# EAGLE design loop-rs232 (EAGLE 6.6.0)
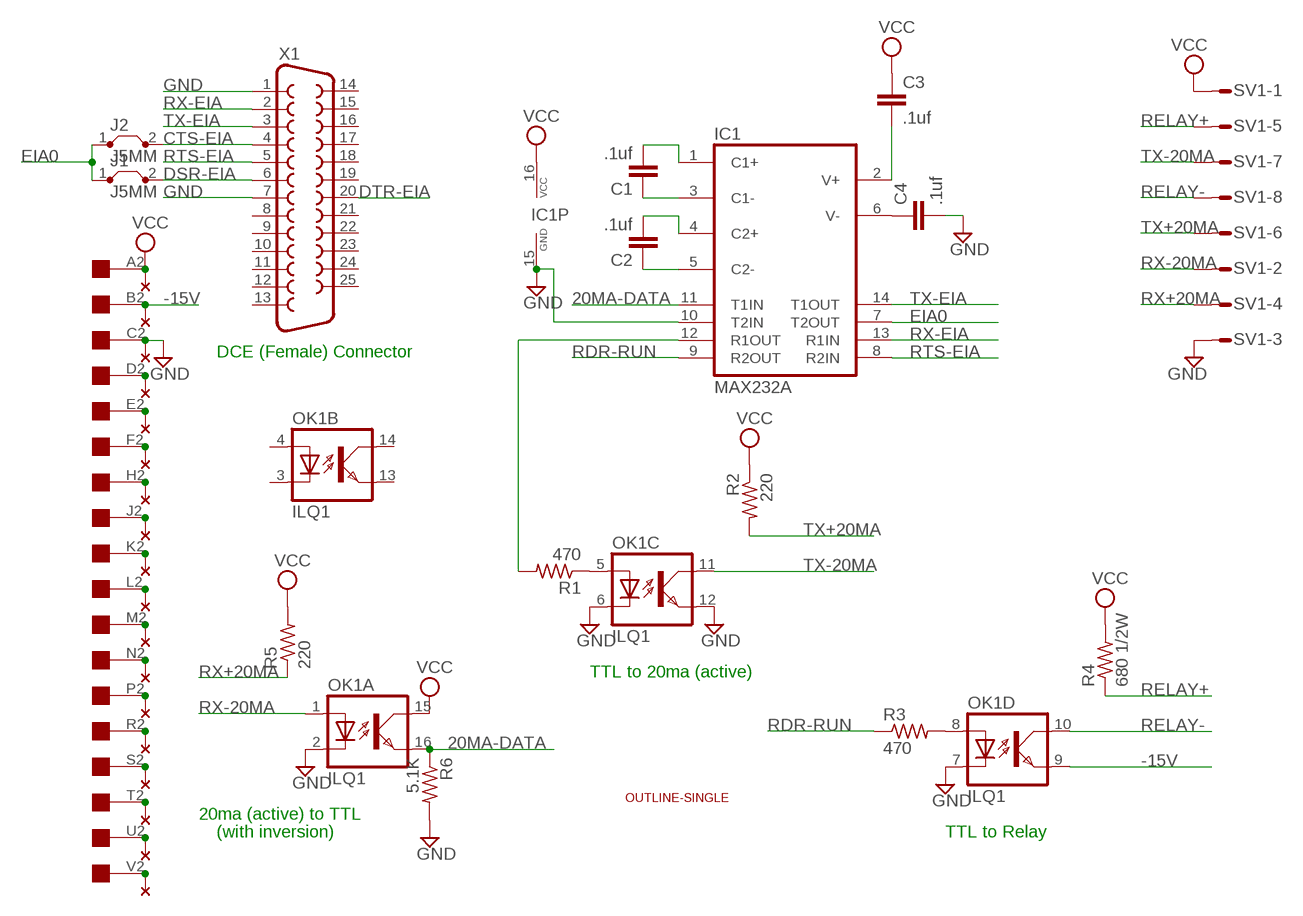
[diagram p0: schematic, sheet 1]

## Parts
C1  .1uf  C-EU050-025X075  [C050-025X075]
C2  .1uf  C-EU050-025X075  [C050-025X075]
C3  .1uf  C-EU050-025X075  [C050-025X075]
C4  .1uf  C-EU050-025X075  [C050-025X075]
IC1  MAX232A  MAX232  [DIL16]
J1  J5MM  [05]
J2  J5MM  [05]
OK1  ILQ1  [DIL16]
R1  470  R-US_0207/10  [0207/10]
R2  220  R-US_0207/10  [0207/10]
R3  470  R-US_0207/10  [0207/10]
R4  680 1/2W  R-US_0207/10  [0207/10]
R5  220  R-US_0207/10  [0207/10]
R6  5.1K  R-US_0207/10  [0207/10]
SV1  S08P  [S08P]
U$2  EDGE-1  [EDGE-CON1]
U$3  OUTLINE-SINGLE  [SINGLE]
U$4  THRU-HOLE1  [THRU-HOLE1]
X1  F25H  [F25H]

## Nets
20MA-DATA: IC1.11(T1IN) OK1.16(A:EMIT) R6.1
-15V: OK1.9(D:EMIT) U$2.B2 U$4.B2
CTS-EIA: J2.2 X1.4
DSR-EIA: J1.2 X1.6
DTR-EIA: X1.20
EIA0: IC1.7(T2OUT) J1.1 J2.1
EIA-DATA: OK1.5(C:A) R1.1
GND: C4.2 IC1.10(T2IN) IC1.15(GND) OK1.2(A:C) OK1.6(C:C) OK1.7(D:C) OK1.12(C:EMIT) R6.2 SV1.3 U$2.C2 U$4.C2 X1.1 X1.7
N$1: C2.1 IC1.5(C2-)
N$2: C2.2 IC1.4(C2+)
N$3: C1.2 IC1.1(C1+)
N$4: C1.1 IC1.3(C1-)
N$5: U$2.V2 U$4.V2
N$6: U$2.U2 U$4.U2
N$7: U$2.T2 U$4.T2
N$8: IC1.12(R1OUT) R1.2
N$9: C3.2 IC1.2(V+)
N$10: C4.1 IC1.6(V-)
N$11: U$2.S2 U$4.S2
N$12: OK1.8(D:A) R3.2
N$13: U$2.R2 U$4.R2
N$14: U$2.P2 U$4.P2
N$15: U$2.N2 U$4.N2
N$16: U$2.M2 U$4.M2
N$17: U$2.L2 U$4.L2
N$18: U$2.K2 U$4.K2
N$19: U$2.J2 U$4.J2
N$20: U$2.H2 U$4.H2
N$21: U$2.F2 U$4.F2
N$22: U$2.E2 U$4.E2
N$23: U$2.D2 U$4.D2
RDR-RUN: IC1.9(R2OUT) R3.1
RELAY+: R4.1 SV1.5
RELAY-: OK1.10(D:COL) SV1.8
RTS-EIA: IC1.8(R2IN) X1.5
RX+20MA: R5.1 SV1.4
RX-20MA: OK1.1(A:A) SV1.2
RX-EIA: IC1.13(R1IN) X1.2
TX+20MA: R2.2 SV1.6
TX-20MA: OK1.11(C:COL) SV1.7
TX-EIA: IC1.14(T1OUT) X1.3
VCC: C3.1 IC1.16(VCC) OK1.15(A:COL) R2.1 R4.2 R5.2 SV1.1 U$2.A2 U$4.A2
Unconnected: OK1.3(B:C) OK1.4(B:A) OK1.13(B:EMIT) OK1.14(B:COL) X1.8 X1.9 X1.10 X1.11 X1.12 X1.13 X1.14 X1.15 X1.16 X1.17 X1.18 X1.19 X1.21 X1.22 X1.23 X1.24 X1.25

## Notes on the sheet
- DCE (Female) Connector
- TTL to 20ma (active)
- 20ma (active) to TTL
- (with inversion) | TTL to Relay

## Library data of the parts
C1-C4 = rcl:C-EU: CAPACITOR, European symbol
IC1 = maxim:MAX232: RS232 TRANSCEIVER; MF: MAXIM; MPN: MAX232ACPE+; OC_FARNELL: 9723773; OC_NEWARK: 68K4544
J1 J2 = jumper:J: Bridge
OK1 = optocoupler:ILQ1: SIEMENS OPTO COUPLER; MF: VISHAY/TELEFUNKEN; MPN: ILQ1; OC_FARNELL: 1469501; OC_NEWARK: 88K1954
R1-R6 = rcl:R-US_: RESISTOR, American symbol
SV1 = con-amp-mt:S08P: AMP MT CONNECTOR; OC_FARNELL: unknown; OC_NEWARK: unknown
U$2 = dec-con:EDGE-1: Single-Sided DEC Edge Connector -- (side 2)
U$3 = dec-con:OUTLINE-*: Board outlines for DEC boards.
U$4 = dec-con:THRU-HOLE1: Thru-Hole addition to double-sided edge connector.
X1 = con-subd:F25: SUB-D; OC_FARNELL: unknown; OC_NEWARK: unknown

## Board
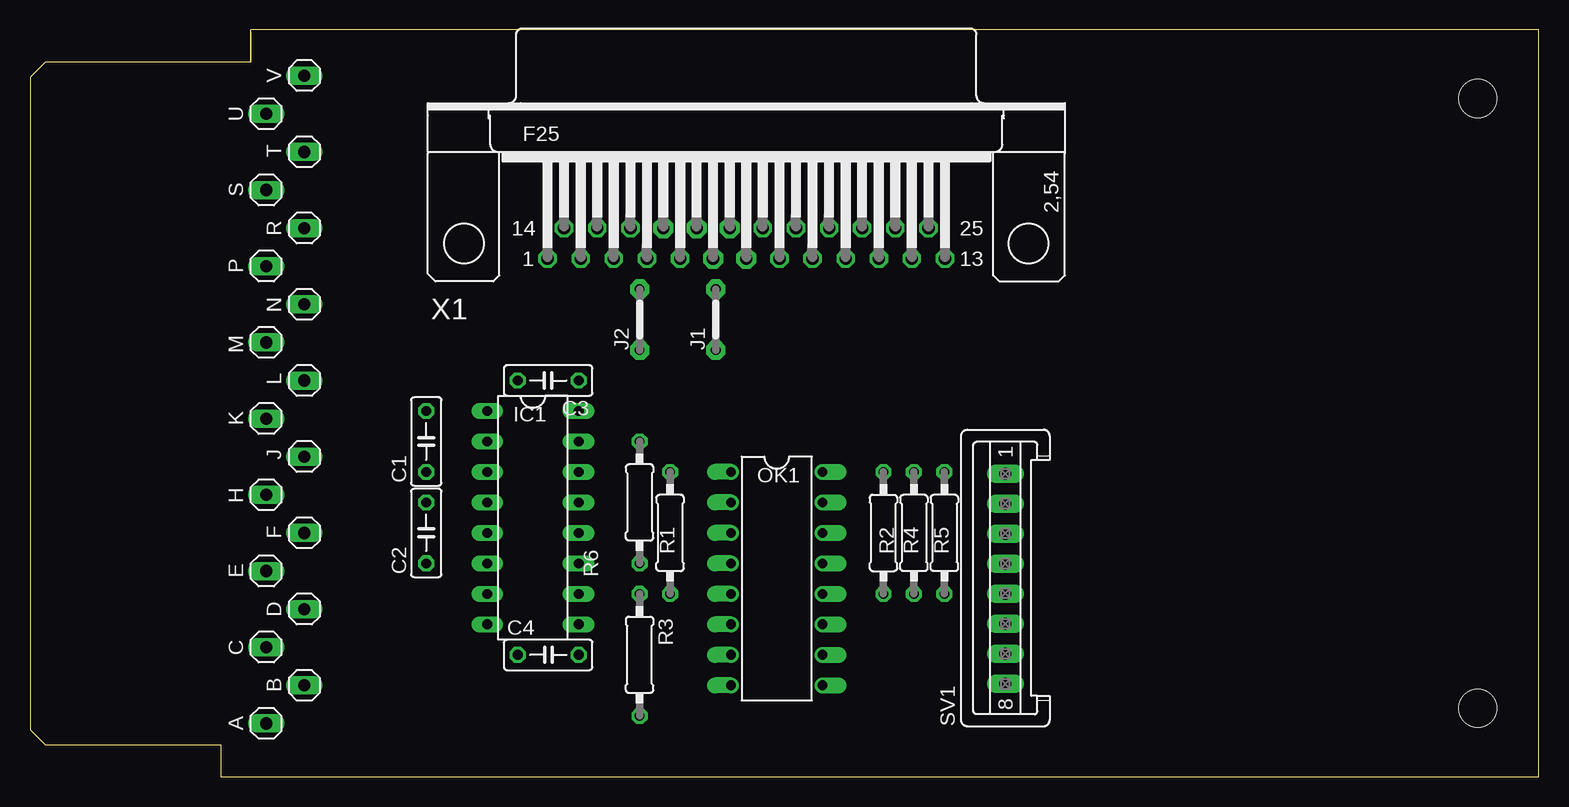
[diagram p1: board, top side]
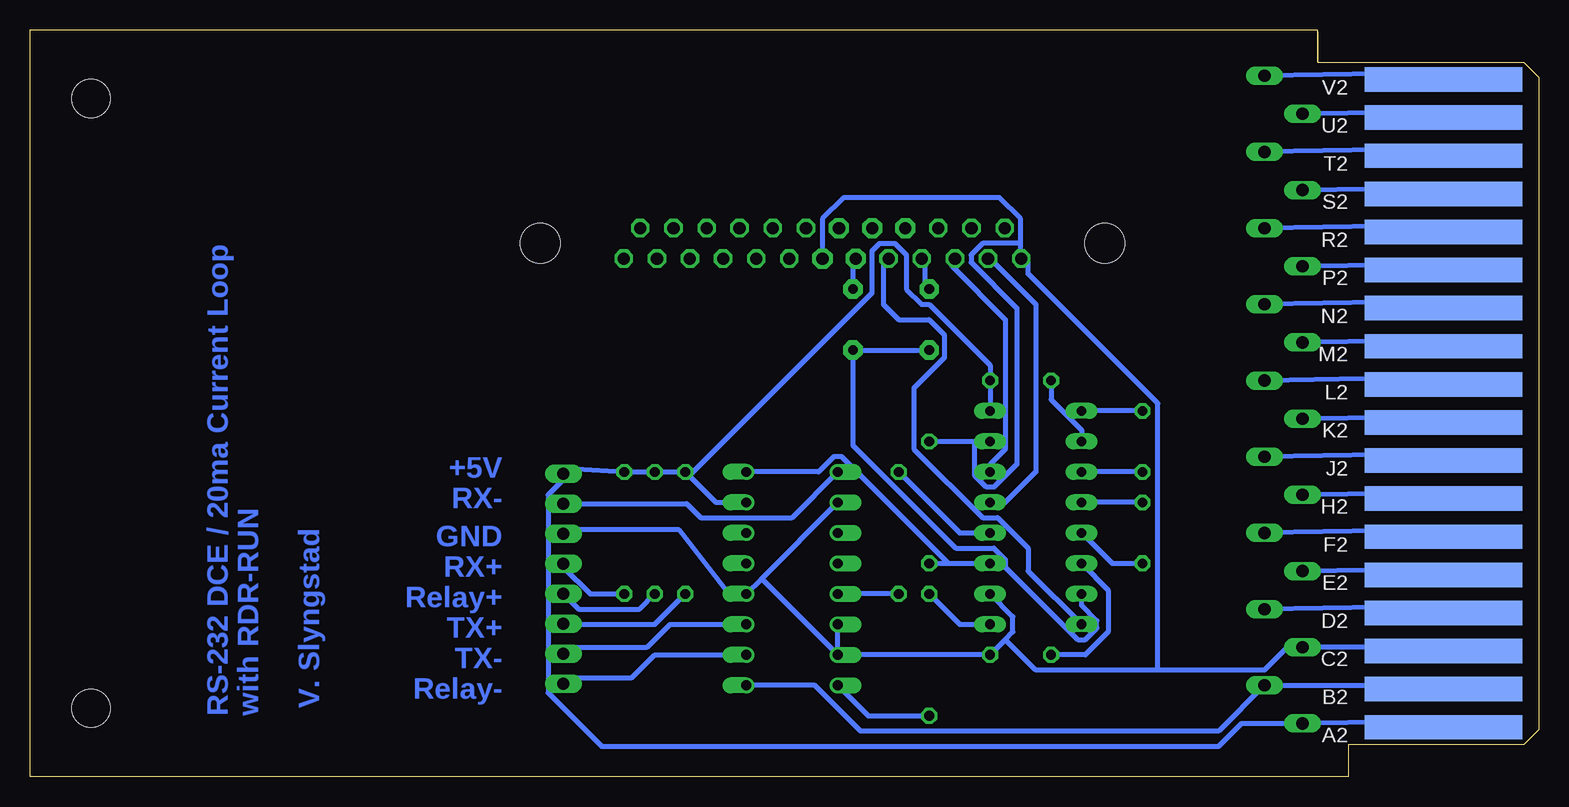
[diagram p2: board, bottom side, seen from below]

Size 125.73 x 62.23 mm. Coordinates in mm from the lower left corner, seen from the top.
Copper layers (1+16): Top 0.035mm / dielectric 1.5mm / Bottom 0.035mm
Design rules "16mils": minimum track width 16mil, minimum drill 32mil, track to track 15mil, track to pad 10mil, pad to pad 10mil, via to via 10mil, smd to smd 10mil, copper to edge 13mil, drill to drill 10mil, minimum pad ring 10mil, minimum via ring 8mil, stop-mask expansion 0mil, vias tented up to drill 0mil, thermal gap 10mil

### Footprints (pad centres in the part's own frame; a part is rotated, then mirrored left to right if it is on the bottom)
C050-025X075 = drill 0.813 octagon: 1 -2.54,0; 2 2.54,0
DIL16 = drill 0.813 long: 1 -8.89,-3.81; 2 -6.35,-3.81; 3 -3.81,-3.81; 4 -1.27,-3.81; 5 1.27,-3.81; 6 3.81,-3.81; 7 6.35,-3.81; 8 8.89,-3.81; 9 8.89,3.81; 10 6.35,3.81; 11 3.81,3.81; 12 1.27,3.81; 13 -1.27,3.81; 14 -3.81,3.81; 15 -6.35,3.81; 16 -8.89,3.81
05 = drill 0.813 pad 1.6 octagon: 1 -2.54,0; 2 2.54,0
DIL16' = drill 0.813 offset: 1 -8.89,-3.81; 2 -6.35,-3.81; 3 -3.81,-3.81; 4 -1.27,-3.81; 5 1.27,-3.81; 6 3.81,-3.81; 7 6.35,-3.81; 8 8.89,-3.81; 9 8.89,3.81; 10 6.35,3.81; 11 3.81,3.81; 12 1.27,3.81; 13 -1.27,3.81; 14 -3.81,3.81; 15 -6.35,3.81; 16 -8.89,3.81
0207/10 = drill 0.813 octagon: 1 -5.08,0; 2 5.08,0
S08P = drill 1.016 long: 1 8.75,0; 2 6.25,0; 3 3.75,0; 4 1.25,0; 5 -1.25,0; 6 -3.75,0; 7 -6.25,0; 8 -8.75,0
EDGE-CON1 = smd 13.106 x 2.032 bottom: A2 7.938,4.128; B2 7.938,7.303; C2 7.938,10.477; D2 7.938,13.652; E2 7.938,16.828; F2 7.938,20.003; H2 7.938,23.177; J2 7.938,26.352; K2 7.938,29.527; L2 7.938,32.703; M2 7.938,35.877; N2 7.938,39.053; P2 7.938,42.227; R2 7.938,45.403; S2 7.938,48.578; T2 7.938,51.752; U2 7.938,54.928; V2 7.938,58.102
SINGLE = hole 3.175: 120.65,56.515; 120.65,5.715
THRU-HOLE1 = drill 1.016 long: A2 28.575,3.175; B2 25.4,6.35; C2 22.225,3.175; D2 19.05,6.35; E2 15.875,3.175; F2 12.7,6.35; H2 9.525,3.175; J2 6.35,6.35; K2 3.175,3.175; L2 0,6.35; M2 -3.175,3.175; N2 -6.35,6.35; P2 -9.525,3.175; R2 -12.7,6.35; S2 -15.875,3.175; T2 -19.05,6.35; U2 -22.225,3.175; V2 -25.4,6.35
F25H = drill 1.016 octagon: 1 -16.561,-1.27; 2 -13.792,-1.27; 3 -11.049,-1.27; 4 -8.28,-1.27; 5 -5.512,-1.27; 8 2.769,-1.27; 9 5.512,-1.27; 10 8.28,-1.27; 11 11.049,-1.27; 12 13.792,-1.27; 13 16.561,-1.27; 14 -15.189,1.27; 15 -12.421,1.27; 16 -9.652,1.27; 20 1.372,1.27; 21 4.14,1.27; 22 6.909,1.27; 23 9.652,1.27; 24 12.421,1.27; 25 15.189,1.27 | drill 1.016 pad 1.67 octagon: 6 -2.769,-1.27; 7 0,-1.27; 17 -6.909,1.27; 18 -4.14,1.27; 19 -1.372,1.27 | hole 3.302: -23.52,0; 23.52,0

### Placement (x,y rotation side)
C1  33.02,27.94 90 top
C2  33.02,20.32 90 top
C3  43.18,33.02 180 top
C4  43.18,10.16 0 top
IC1  41.91,21.59 270 top
J1  57.15,38.1 90 top
J2  50.8,38.1 90 top
OK1  ILQ1  [DIL16']  62.23,16.51 270 top
R1  53.34,20.32 90 top
R2  71.12,20.32 270 top
R3  50.8,10.16 270 top
R4  73.66,20.32 90 top
R5  76.2,20.32 90 top
R6  50.8,22.86 90 top
SV1  81.28,16.51 90 top
U$2  0,0 0 top
U$3  0,0 0 top
U$4  16.51,33.02 270 top
X1  59.69,44.45 0 top

### Tracks (layer width: path | path; a pad name or v marks a point on that pad's centre or on a via)
20MA-DATA
  Bottom 0.406: R6.1 49.21,17.78 | 49.21,17.78 IC1.11 | OK1.16 60.01,25.4 58.74,26.67 58.1,26.67 49.21,17.78
-15V
  Bottom 0.406: OK1.9 60.33,7.62 56.52,3.81 26.67,3.81 U$4.B2 8.26,7.62 U$2.B2
CTS-EIA
  Bottom 0.406: J2.2 51.12,40.96 51.12,43.18 X1.4
DSR-EIA
  Bottom 0.406: J1.2 57.15,43.18 X1.6
EIA0
  Bottom 0.406: IC1.7 38.1,14.29 36.83,13.02 36.83,12.38 37.78,11.43 38.42,11.43 44.45,17.46 44.45,18.1 45.4,19.05 48.58,19.05 57.15,27.62 J1.1 J2.1
EIA-DATA
  Bottom 0.406: R1.1 OK1.5
GND
  Bottom 0.406: 43.18,44.45 43.18,46.48 44.96,48.26 57.91,48.26 59.69,46.48 X1.7 | 43.18,44.45 43.18,43.69 X1.1 42.55,43.18 42.55,41.91 31.75,31.11 31.75,8.89 | 43.18,44.45 46.36,44.45 47.31,43.5 47.31,42.86 43.5,39.05 43.5,26.04 45.4,24.13 46.04,24.13 46.99,25.08 46.99,27.94 | SV1.3 80.26,20.57 71.63,20.57 67.31,14.99 OK1.12 64.77,16.51 | OK1.7 C4.2 44.45,11.43 | IC1.10 43.82,13.34 43.82,12.06 44.45,11.43 | U$2.C2 8.26,10.79 U$4.C2 20.96,10.79 22.86,8.89 31.75,8.89 | 44.45,11.43 41.91,8.89 31.75,8.89 | 64.77,16.51 OK1.2 | OK1.7 OK1.6 | 64.77,16.51 OK1.7 | R6.2 46.99,27.94 | 46.99,27.94 IC1.15
N$1
  Bottom 0.406: C2.1 35.56,17.78 IC1.5
N$2
  Bottom 0.406: C2.2 IC1.4
N$3
  Bottom 0.406: C1.2 IC1.1
N$4
  Bottom 0.406: C1.1 IC1.3
N$5
  Bottom 0.406: U$4.V2 8.26,58.67 U$2.V2
N$6
  Bottom 0.406: U$4.U2 8.38,55.37 U$2.U2
N$7
  Bottom 0.406: U$4.T2 8.26,52.32 U$2.T2
N$8
  Bottom 0.406: IC1.12 48.26,20.32 R1.2
N$9
  Bottom 0.406: IC1.2 38.1,28.89 40.64,31.43 C3.2
N$10
  Bottom 0.406: C4.1 37.78,10.16 35.88,12.06 35.88,15.56 IC1.6
N$11
  Bottom 0.406: U$4.S2 8.38,49.02 U$2.S2
N$12
  Bottom 0.406: R3.2 55.88,5.08 OK1.8
N$13
  Bottom 0.406: U$4.R2 8.26,45.97 U$2.R2
N$14
  Bottom 0.406: U$4.P2 8.38,42.67 U$2.P2
N$15
  Bottom 0.406: U$4.N2 8.26,39.62 U$2.N2
N$16
  Bottom 0.406: U$4.M2 8.38,36.32 U$2.M2
N$17
  Bottom 0.406: U$4.L2 8.26,33.27 U$2.L2
N$18
  Bottom 0.406: U$4.K2 8.38,29.97 U$2.K2
N$19
  Bottom 0.406: U$4.J2 8.26,26.92 U$2.J2
N$20
  Bottom 0.406: U$4.H2 8.38,23.62 U$2.H2
N$21
  Bottom 0.406: U$4.F2 8.26,20.57 U$2.F2
N$22
  Bottom 0.406: U$4.E2 8.38,17.27 U$2.E2
N$23
  Bottom 0.406: U$4.D2 8.26,14.22 U$2.D2
RDR-RUN
  Bottom 0.406: IC1.9 48.26,12.7 R3.1
RELAY+
  Bottom 0.406: R4.1 74.93,13.97 80.01,13.97 81.28,15.24 SV1.5
RELAY-
  Bottom 0.406: OK1.10 73.66,10.16 75.57,8.26 81.28,8.26 SV1.8
RTS-EIA
  Bottom 0.406: IC1.8 42.55,17.14 42.55,19.05 45.09,21.59 46.36,21.59 52.07,27.3 52.07,32.38 49.53,34.92 49.53,36.83 50.8,38.1 53.34,38.1 54.61,39.37 54.61,42.55 X1.5
RX+20MA
  Bottom 0.406: R5.1 79.06,15.24 81.28,17.46 SV1.4
RX-20MA
  Bottom 0.406: SV1.2 71.02,22.76 69.85,21.59 62.23,21.59 OK1.1
RX-EIA
  Bottom 0.406: IC1.13 44.45,22.86 41.91,25.4 41.91,39.37 45.72,43.18 X1.2
TX+20MA
  Bottom 0.406: R2.2 73.66,12.7 81.28,12.7 SV1.6
TX-20MA
  Bottom 0.406: OK1.11 72.39,12.7 74.3,10.79 81.28,10.79 SV1.7
TX-EIA
  Bottom 0.406: IC1.14 45.72,26.04 44.45,27.3 44.45,38.1 48.9,42.55 48.9,43.18 X1.3
VCC
  Bottom 0.406: U$2.A2 8.38,4.57 U$4.A2 24.77,4.45 26.67,2.54 78.11,2.54 82.55,6.99 82.55,23.5 81.28,24.77 SV1.1 80.26,25.65 R5.2 R4.2 R2.1 70.8,25.08 | IC1.16 C3.1 45.72,34.29 50.8,39.37 51.44,39.37 52.71,40.64 52.71,43.5 53.66,44.45 54.93,44.45 55.56,43.81 55.56,40.32 70.8,25.08 | OK1.15 68.58,22.86 70.8,25.08

### Text on the board
Bottom: +5V | RX- | GND | RX+ | Relay+ | TX+ | TX- | Relay- | V. Slyngstad | with RDR-RUN | RS-232 DCE / 20ma Current Loop